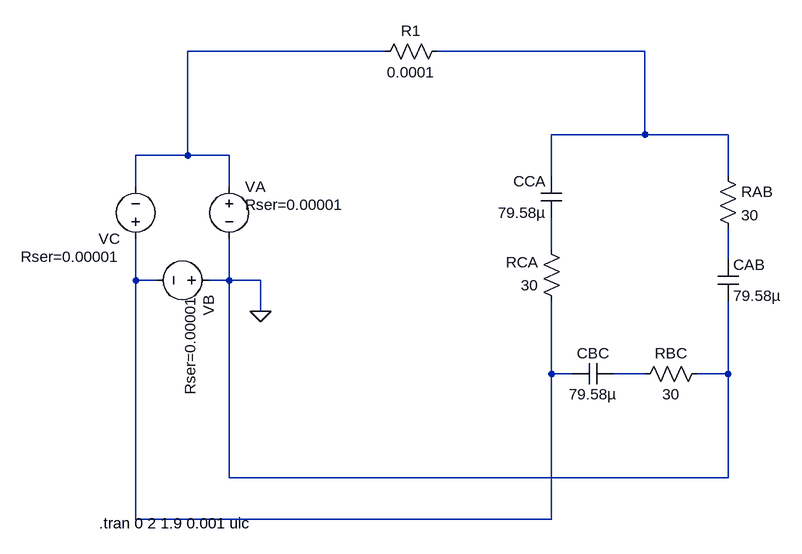
[diagram p0: schematic Trisfazu kede.asc]
Trisfazu kede.asc, the LTspice schematic file:
Version 4
SHEET 1 880 712
WIRE 224 -32 -80 -32
WIRE 624 -32 304 -32
WIRE 624 96 624 -32
WIRE 624 96 480 96
WIRE 752 96 624 96
WIRE -80 128 -80 -32
WIRE -80 128 -160 128
WIRE -16 128 -80 128
WIRE 480 160 480 96
WIRE 752 160 752 96
WIRE -160 176 -160 128
WIRE -16 176 -16 128
WIRE 480 272 480 224
WIRE 752 288 752 240
WIRE -160 320 -160 256
WIRE -128 320 -160 320
WIRE -16 320 -16 256
WIRE -16 320 -48 320
WIRE 32 320 -16 320
WIRE 32 368 32 320
WIRE 480 464 480 352
WIRE 512 464 480 464
WIRE 624 464 576 464
WIRE 752 464 752 352
WIRE 752 464 704 464
WIRE -16 624 -16 320
WIRE 752 624 752 464
WIRE 752 624 -16 624
WIRE -160 688 -160 320
WIRE 480 688 480 464
WIRE 480 688 -160 688
FLAG 32 368 0
SYMBOL voltage -16 160 R0
WINDOW 3 24 96 Invisible 2
WINDOW 123 0 0 Left 0
WINDOW 39 24 44 Left 2
SYMATTR InstName VA
SYMATTR Value SINE(0 250 50 0 0 90)
SYMATTR SpiceLine Rser=0.00001
SYMBOL voltage -160 272 R180
WINDOW 3 24 96 Invisible 2
WINDOW 123 0 0 Left 0
WINDOW 39 24 -12 Left 2
SYMATTR InstName VC
SYMATTR Value SINE(0 250 50 0 0 -150)
SYMATTR SpiceLine Rser=0.00001
SYMBOL voltage -32 320 R90
WINDOW 3 24 96 Invisible 2
WINDOW 123 0 0 Left 0
WINDOW 39 24 44 Left 2
SYMATTR InstName VB
SYMATTR Value SINE(0 250 50 0 0 -30)
SYMATTR SpiceLine Rser=0.00001
SYMBOL res 736 144 R0
SYMATTR InstName RAB
SYMATTR Value 30
SYMBOL cap 736 288 R0
SYMATTR InstName CAB
SYMATTR Value 79.58µ
SYMBOL res 496 368 R180
WINDOW 0 36 76 Left 2
WINDOW 3 36 40 Left 2
SYMATTR InstName RCA
SYMATTR Value 30
SYMBOL cap 496 224 R180
WINDOW 0 24 56 Left 2
WINDOW 3 24 8 Left 2
SYMATTR InstName CCA
SYMATTR Value 79.58µ
SYMBOL res 720 448 R90
WINDOW 0 0 56 VBottom 2
WINDOW 3 32 56 VTop 2
SYMATTR InstName RBC
SYMATTR Value 30
SYMBOL cap 576 448 R90
WINDOW 0 0 32 VBottom 2
WINDOW 3 32 32 VTop 2
SYMATTR InstName CBC
SYMATTR Value 79.58µ
SYMBOL res 208 -16 R270
WINDOW 0 32 56 VTop 2
WINDOW 3 0 56 VBottom 2
SYMATTR InstName R1
SYMATTR Value 0.0001
TEXT -216 694 Left 2 !.tran 0 2 1.9 0.001 uic

The netlist it stands for:
* Trisfazu kede.asc
VA N001 0 SINE(0 250 50 0 0 90) Rser=0.00001
VC N005 N001 SINE(0 250 50 0 0 -150) Rser=0.00001
VB 0 N005 SINE(0 250 50 0 0 -30) Rser=0.00001
RAB N002 N004 30
CAB N004 0 79.58µ
RCA N005 N003 30
CCA N003 N002 79.58µ
RBC 0 N006 30
CBC N006 N005 79.58µ
R1 N001 N002 0.0001
.tran 0 2 1.9 0.001 uic
.backanno
.end